# EAGLE schematic schematicamitfix (EAGLE 8.6.0)
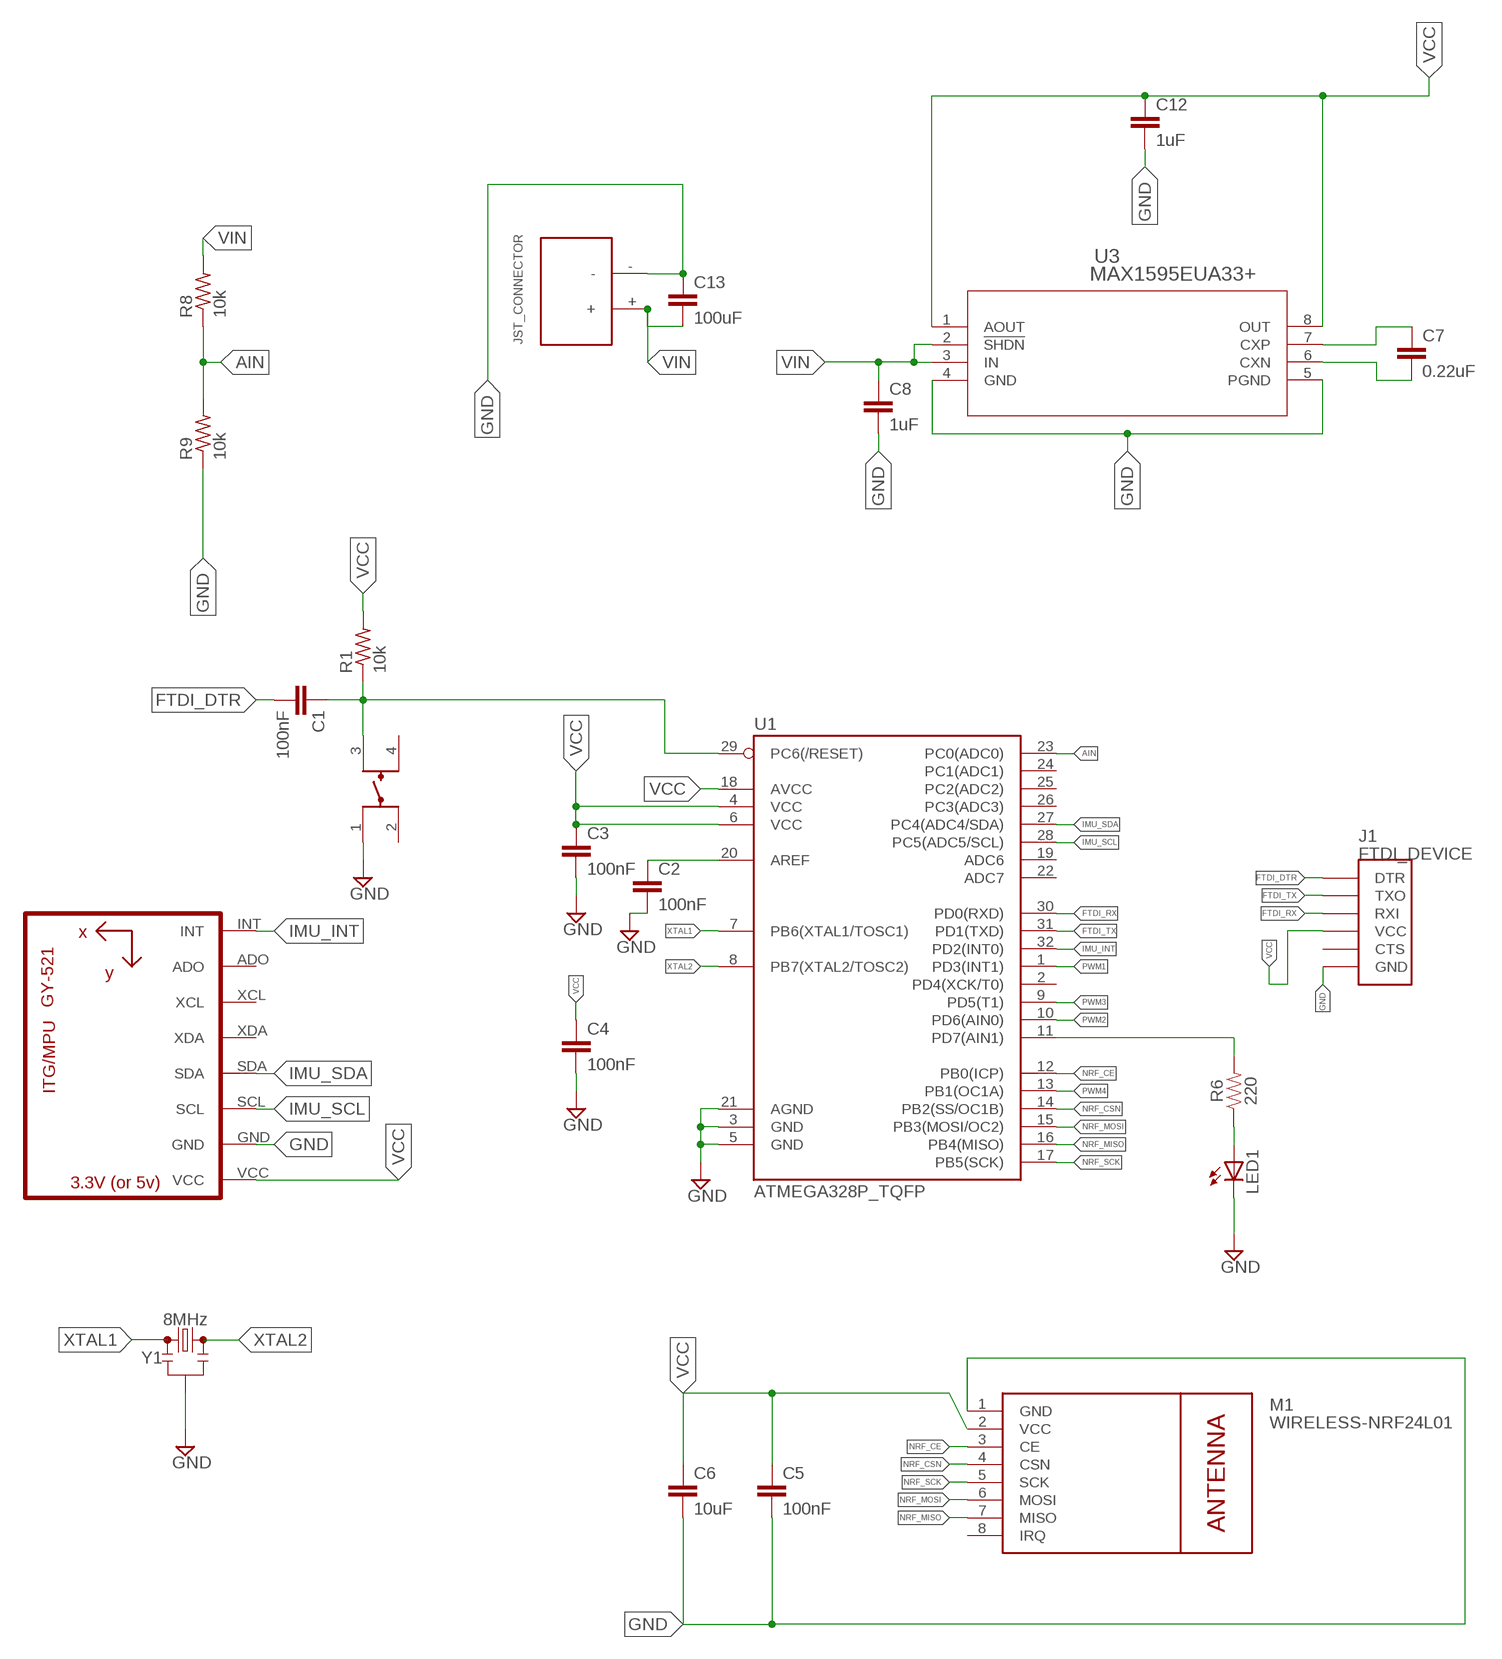
[diagram p0: schematic, sheet 1, part 1 of 3]
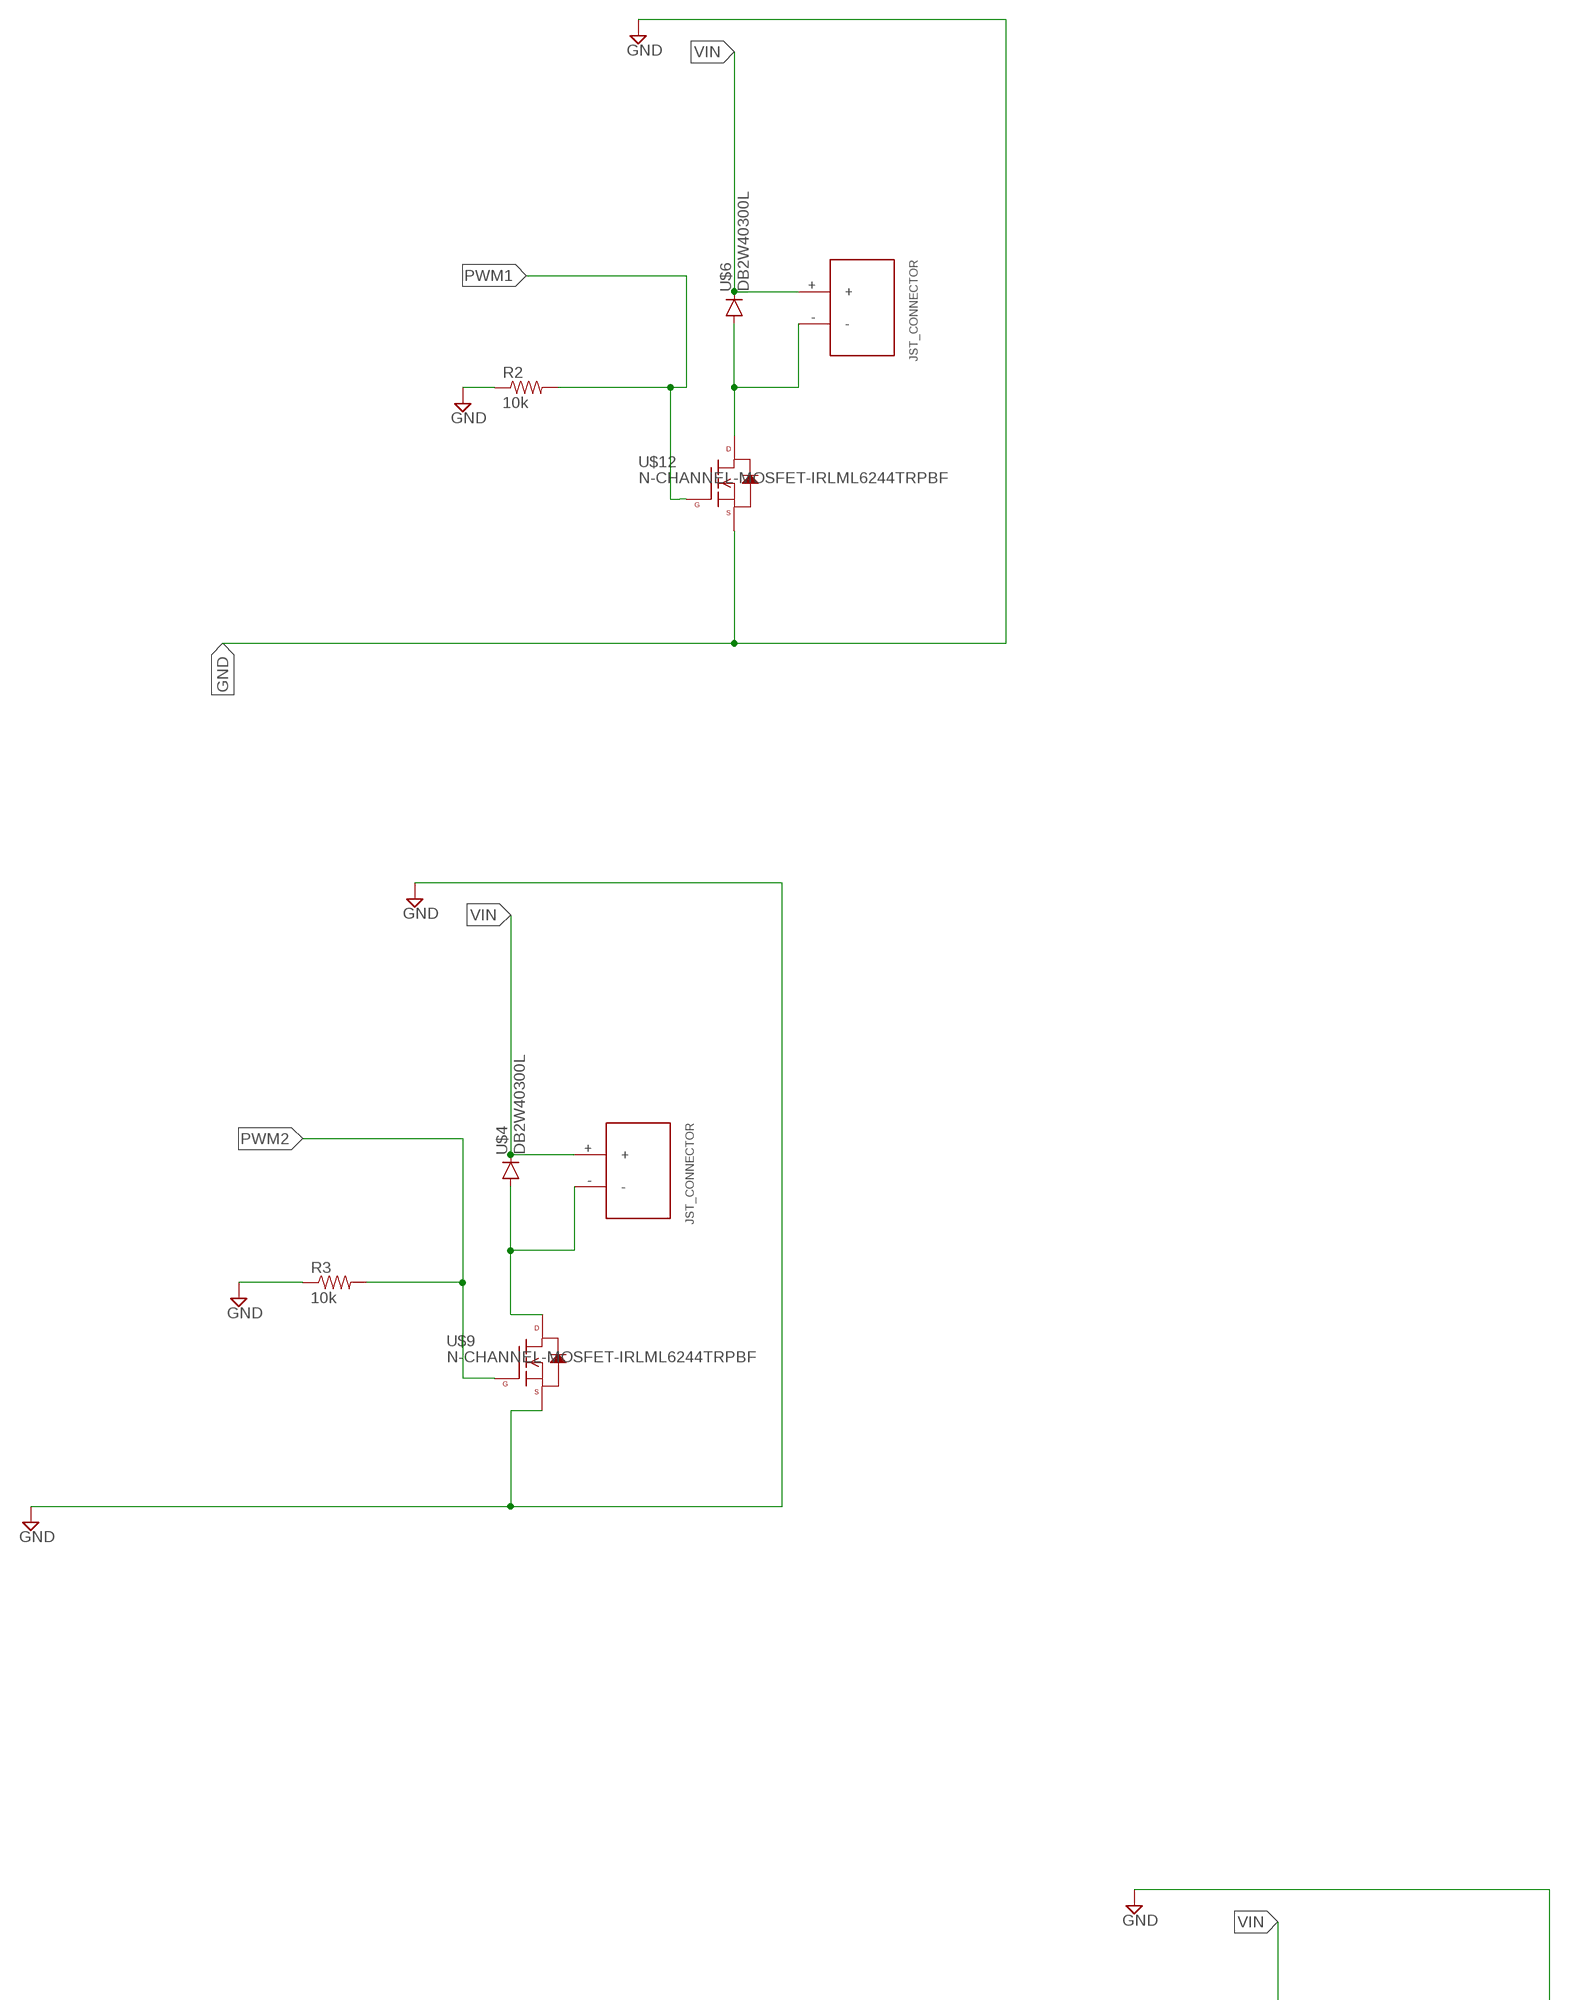
[diagram p1: schematic, sheet 1, part 2 of 3]
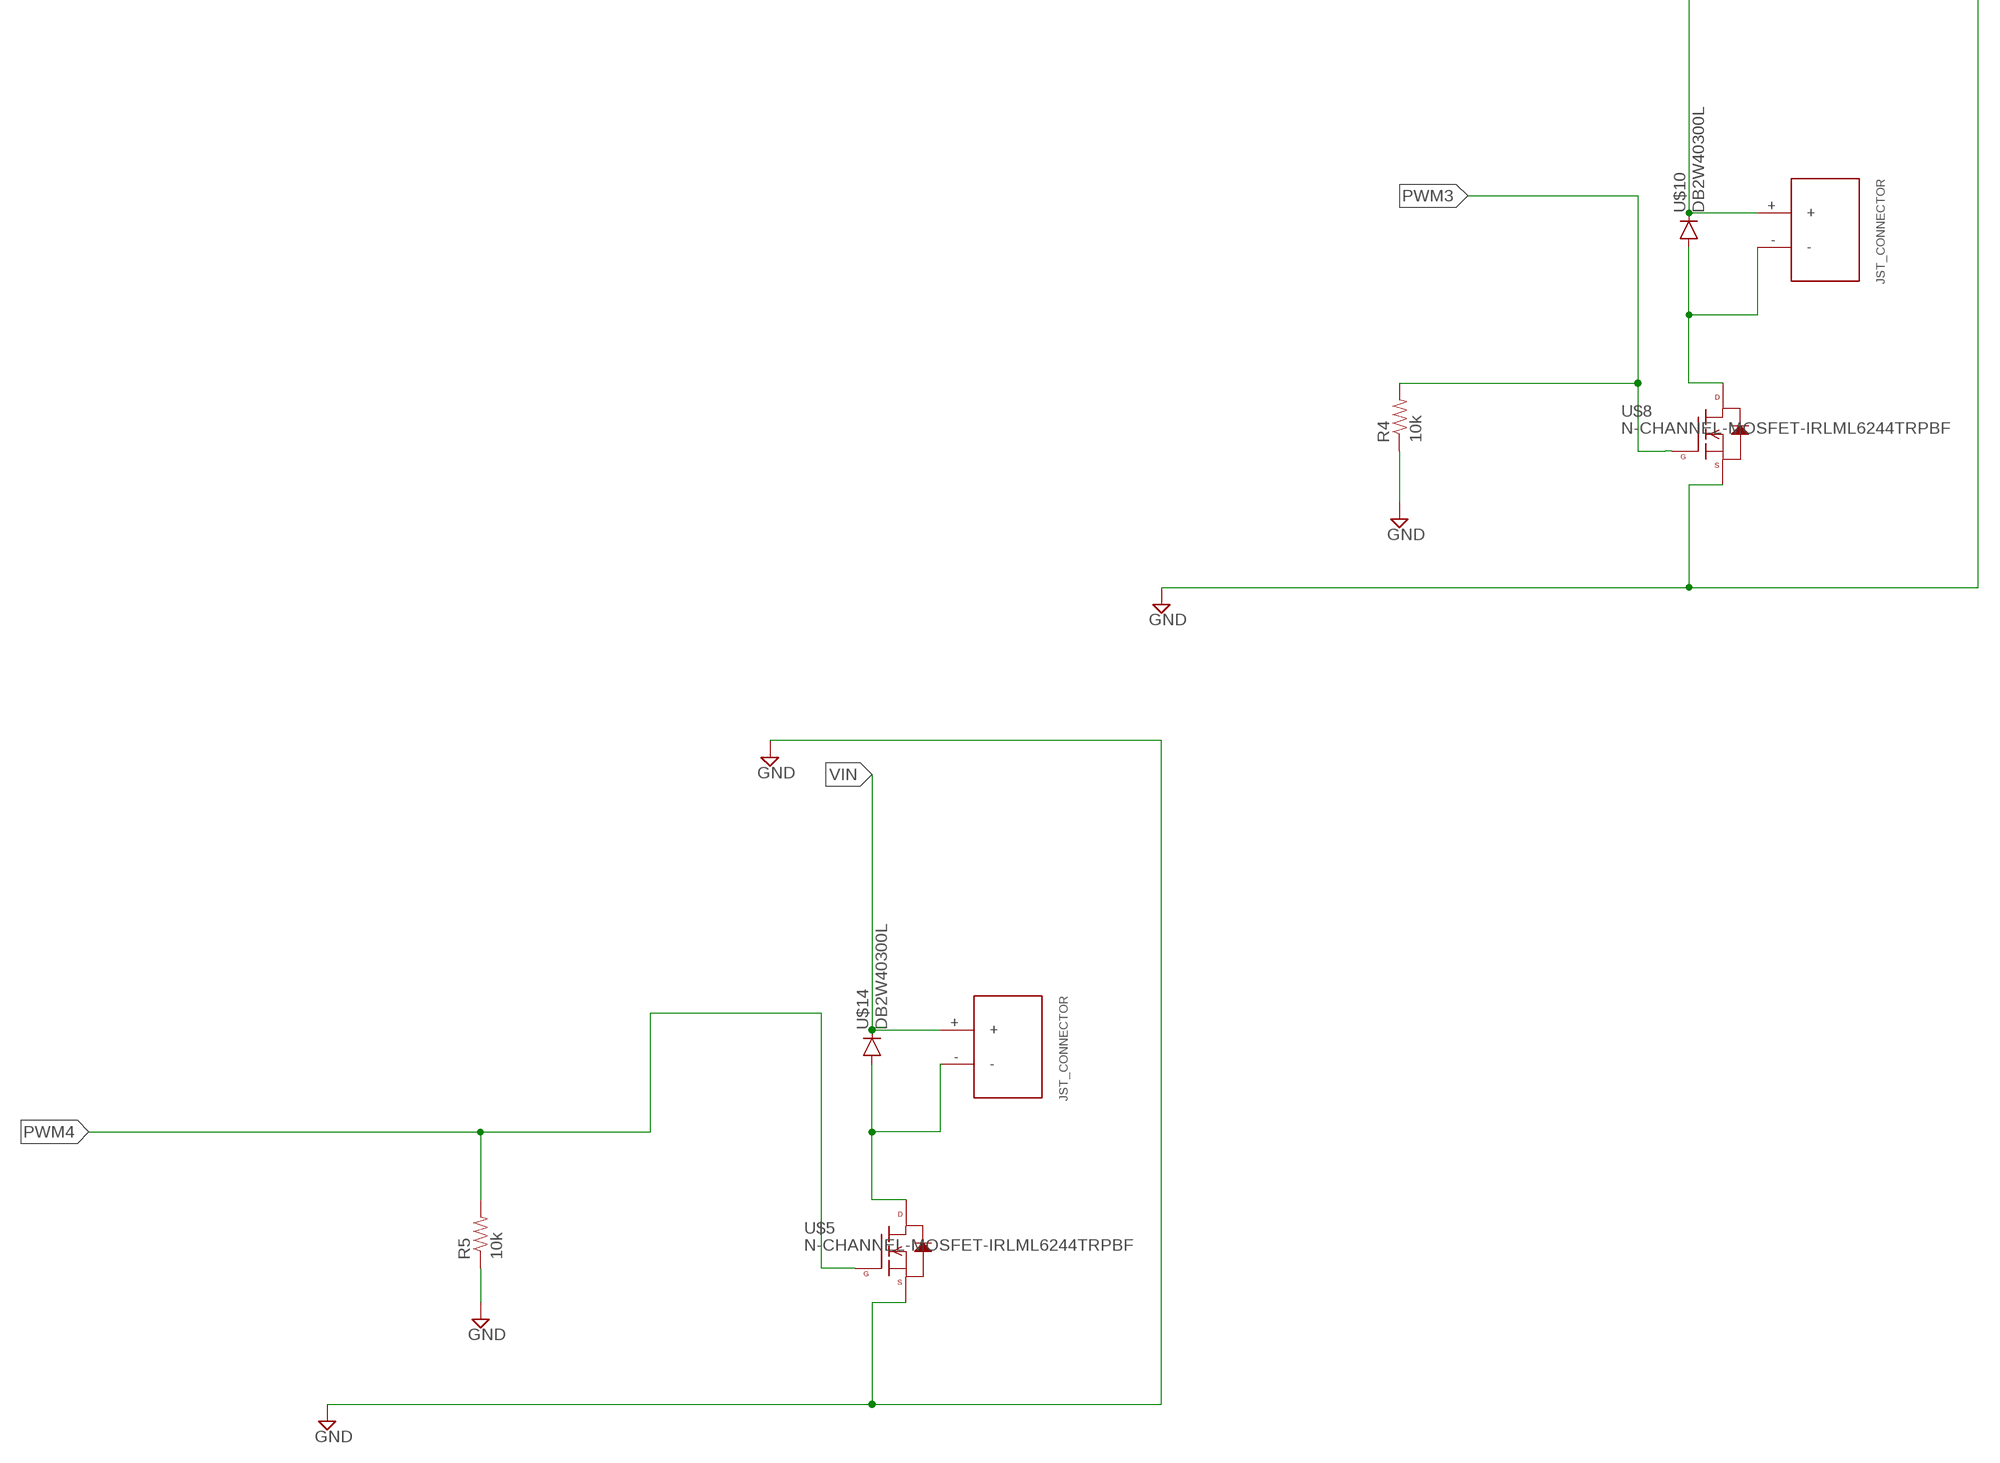
[diagram p2: schematic, sheet 1, part 3 of 3]

## Parts
C1  100nF  C-EUC0603  [C0603]
C2  100nF  C-EUC0603  [C0603]
C3  100nF  C-EUC0603  [C0603]
C4  100nF  C-EUC0603  [C0603]
C5  100nF  C-EUC0603  [C0603]
C6  10uF  C-EUC0603  [C0603]
C7  0.22uF  C-EUC0603  [C0603]
C8  1uF  C-EUC0805  [C0805]
C12  1uF  C-EUC0805  [C0805]
C13  100uF  C-EUC1210  [C1210]
J1  FTDI_DEVICE  [FTDI_DEVICE_SIDE]
LED1  LED1206  [LED-1206]
M1  WIRELESS-NRF24L01  [WIRELESS-NRF24L01]
R1  10k  R-US_R0603  [R0603]
R2  10k  RESISTOR0603  [0603-RES]
R3  10k  RESISTOR0603  [0603-RES]
R4  10k  RESISTOR0603  [0603-RES]
R5  10k  RESISTOR0603  [0603-RES]
R6  220  220OHM-0603-1/10W-1%  [0603]
R8  10k  R-US_R0603  [R0603]
R9  10k  R-US_R0603  [R0603]
U1  ATMEGA328P_TQFP  [TQFP32-08]
U2  GY-521MPU6050  [GY-521]
U3  MAX1595EUA33+  [21-0036K]
U$1  LL3301NF065QG  [LL3301NF065QG]
U$3  JST_CONNECTOR_FEMALE  [JST_CONNECTOR_FEMALE]
U$4  DB2W40300L  [MINI2-F3-B]
U$5  N-CHANNEL-MOSFET-IRLML6244TRPBF  [SOT23-3]
U$6  DB2W40300L  [MINI2-F3-B]
U$7  JST_CONNECTOR_FEMALE  [JST_CONNECTOR_FEMALE]
U$8  N-CHANNEL-MOSFET-IRLML6244TRPBF  [SOT23-3]
U$9  N-CHANNEL-MOSFET-IRLML6244TRPBF  [SOT23-3]
U$10  DB2W40300L  [MINI2-F3-B]
U$11  JST_CONNECTOR_FEMALE  [JST_CONNECTOR_FEMALE]
U$12  N-CHANNEL-MOSFET-IRLML6244TRPBF  [SOT23-3]
U$14  DB2W40300L  [MINI2-F3-B]
U$15  JST_CONNECTOR_FEMALE  [JST_CONNECTOR_FEMALE]
U$19  JST_CONNECTOR_FEMALE  [JST_CONNECTOR_FEMALE]
Y1  8MHz  RESONATOR-8MHZSMD_3.2X1.3  [RESONATOR-SMD-3.2X1.3]

## Nets
AIN: R8.1 R9.2 U1.23(PC0(ADC0))
FTDI_DTR: C1.2 J1.P$1(DTR)
FTDI_RX: J1.P$3(RXI) U1.30(PD0(RXD))
FTDI_TX: J1.P$2(TXO) U1.31(PD1(TXD))
GND: C2.2 C3.2 C4.2 C5.2 C6.2 C8.2 C12.2 C13.1 J1.P$6(GND) LED1.C M1.1(GND) R2.1 R3.1 R4.1 R5.1 R9.1 U1.3(GND) U1.5(GND) U1.21(AGND) U2.GND U3.4(GND) U3.5(PGND) U$1.1 U$5.2(S) U$8.2(S) U$9.2(S) U$12.2(S) U$19.- Y1.2
IMU_INT: U1.32(PD2(INT0)) U2.INT
IMU_SCL: U1.28(PC5(ADC5/SCL)) U2.SCL
IMU_SDA: U1.27(PC4(ADC4/SDA)) U2.SDA
N$1: C1.1 R1.1 U1.29(PC6(/RESET)) U$1.3
N$2: C2.1 U1.20(AREF)
N$5: U$3.- U$4.POS(PPIN) U$9.3(D)
N$6: C7.1 U3.7(CXP)
N$7: R6.2 U1.11(PD7(AIN1))
N$9: U$6.POS(PPIN) U$7.- U$12.3(D)
N$10: C7.2 U3.6(CXN)
N$11: LED1.A R6.1
N$13: U$8.3(D) U$10.POS(PPIN) U$11.-
N$17: U$5.3(D) U$14.POS(PPIN) U$15.-
NRF_CE: M1.3(CE) U1.12(PB0(ICP))
NRF_CSN: M1.4(CSN) U1.14(PB2(SS/OC1B))
NRF_MISO: M1.7(MISO) U1.16(PB4(MISO))
NRF_MOSI: M1.6(MOSI) U1.15(PB3(MOSI/OC2))
NRF_SCK: M1.5(SCK) U1.17(PB5(SCK))
PWM1: R2.2 U1.1(PD3(INT1)) U$12.1(G)
PWM2: R3.2 U1.10(PD6(AIN0)) U$9.1(G)
PWM3: R4.2 U1.9(PD5(T1)) U$8.1(G)
PWM4: R5.2 U1.13(PB1(OC1A)) U$5.1(G)
VCC: C3.1 C4.1 C5.1 C6.1 C12.1 J1.P$4(VCC) M1.2(VCC) R1.2 U1.4(VCC) U1.6(VCC) U1.18(AVCC) U2.VCC U3.1(AOUT) U3.8(OUT)
VIN: C8.1 C13.2 R8.2 U3.2(!SHDN) U3.3(IN) U$3.+ U$4.NEG(GPIN) U$6.NEG(GPIN) U$7.+ U$10.NEG(GPIN) U$11.+ U$14.NEG(GPIN) U$15.+ U$19.+
XTAL1: U1.7(PB6(XTAL1/TOSC1)) Y1.1
XTAL2: U1.8(PB7(XTAL2/TOSC2)) Y1.3
Unconnected: J1.P$5(CTS) M1.8(IRQ) U1.2(PD4(XCK/T0)) U1.19(ADC6) U1.22(ADC7) U1.24(PC1(ADC1)) U1.25(PC2(ADC2)) U1.26(PC3(ADC3)) U2.ADO U2.XCL U2.XDA U$1.2 U$1.4

## Library data of the parts
C1-C8 C12 C13 = rcl:C-EU: CAPACITOR, European symbol; SPICEPREFIX: C
J1 = quad:FTDI_DEVICE: Connector which mates to FTDI basic or FTDI cable.
LED1 = LilyPad-Wearables:LED: LEDs Standard schematic elements and footprints for 5mm, 3mm, 1206, and 0603 sized LEDs. 5mm - Spark Fun Electronics SKU : Comp-SBL
M1 = quad:WIRELESS-NRF24L01: 2.4 GHz Wireless Module based on NRF24L01 chip
R1 R8 R9 = rcl:R-US_: RESISTOR, American symbol; SPICEPREFIX: R
R2-R5 = SparkFun-Resistors:RESISTOR: Resistor Basic schematic elements and footprints for 0603, 1206, and PTH resistors.
R6 = SparkFun-Resistors:220OHM: 220Ω resistor A resistor is a passive two-terminal electrical component that implements electrical resistance as a circuit element. Resistors act to reduce current flow, and, at the same time, act to lower voltage levels within circuits. - Wikipedia; PROD_ID: RES-07861
U1 = quad:ATMEGA328P_TQFP; PROD_ID: IC-09069
U2 = quad:GY-521
U3 = MAX1595EUA33+:MAX1595EUA33+; MANUFACTURER_PART_NUMBER: MAX1595EUA33+; VENDOR: Maxim Integrated Products
U$1 = E-Switch:LL3301NF065QG
U$3 U$7 U$11 U$15 U$19 = quad:JST_CONNECTOR_FEMALE
U$4 U$6 U$10 U$14 = quad:DB2W40300L
U$5 U$8 U$9 U$12 = quad:N-CHANNEL-MOSFET: N-Channel MOSFET Mode Field Effect Transistor; DATASHEET: http://www.mouser.com/ds/2/196/irlml6244pbf-936666.pdf; MOUSER: 942-IRLML6244TRPBF; URL: http://www.mouser.com/Search/ProductDetail.aspx?R=IRLML6244TRPBFvirtualkey57370000virtualkey942-IRLML6244TRPBF
Y1 = SparkFun-Clocks:RESONATOR-8MHZ: 8MHz Resonator Digikey Example <http://www.digikey.com/product-detail/en/murata-electronics-north-america/CSTCE10M0G55-R0/490-1196-1-ND/584633> Frequency: 8MHz Frequency Stability: ±0.2% Frequency Tolerance: ±0.5% Capacitance: 33pF SparkFun Products Arduino Pro Mini 328- 3.3V/8MHz <https://www.sparkfun.com/products/11114> SparkFun Digital Sandbox <https://www.sparkfun.com/products/12651>; PROD_ID: XTAL-08895